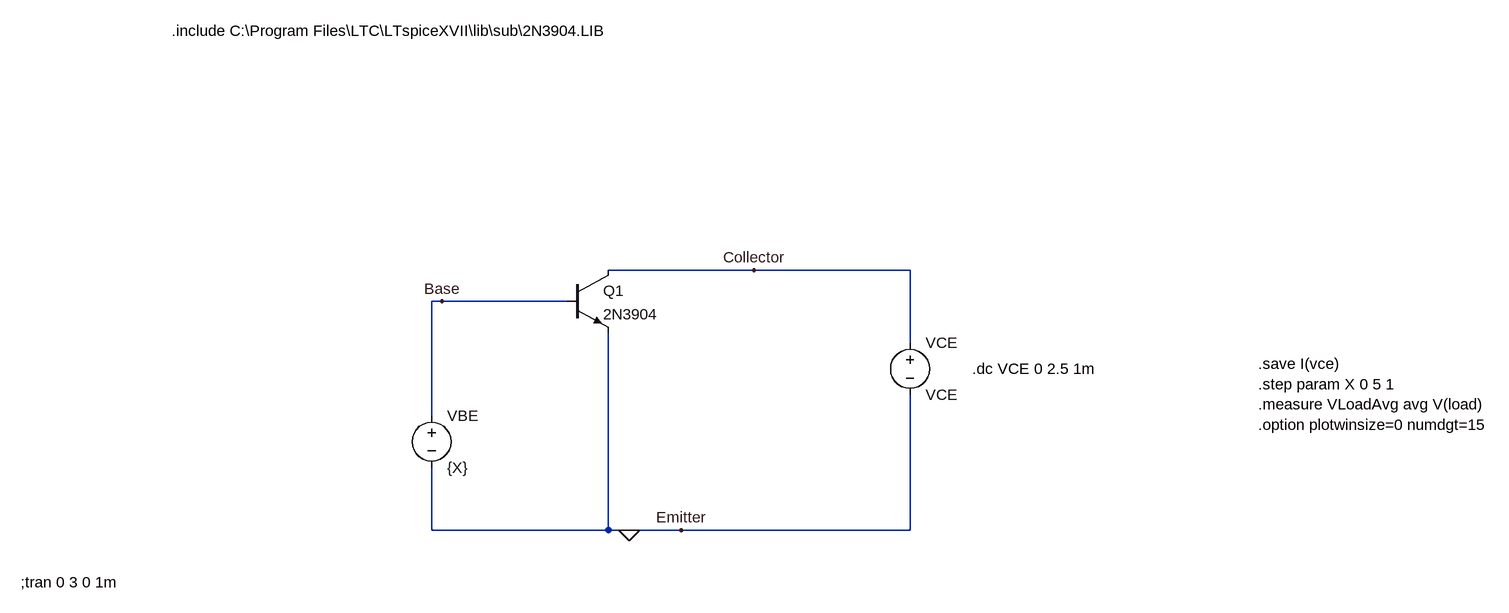
[diagram p0: schematic mp2 task 1B 2N3904 profiling.asc]
mp2 task 1B 2N3904 profiling.asc, the LTspice schematic file:
Version 4
SHEET 1 2560 912
WIRE 1072 400 848 400
WIRE 1312 400 1072 400
WIRE 592 448 576 448
WIRE 784 448 592 448
WIRE 1312 512 1312 400
WIRE 576 624 576 448
WIRE 576 800 576 704
WIRE 848 800 848 496
WIRE 848 800 576 800
WIRE 880 800 848 800
WIRE 960 800 880 800
WIRE 1312 800 1312 592
WIRE 1312 800 960 800
FLAG 880 800 0
FLAG 592 448 Base
FLAG 1072 400 Collector
FLAG 960 800 Emitter
SYMBOL voltage 576 608 R0
WINDOW 123 0 0 Left 0
WINDOW 39 0 0 Left 0
SYMATTR InstName VBE
SYMATTR Value {X}
SYMBOL voltage 1312 496 R0
WINDOW 123 0 0 Left 0
WINDOW 39 0 0 Left 0
SYMATTR InstName VCE
SYMATTR Value VCE
SYMBOL npn 784 400 R0
SYMATTR InstName Q1
SYMATTR Value 2N3904
TEXT -56 880 Left 2 !;tran 0 3 0 1m
TEXT 176 32 Left 2 !.include C:\\Program Files\\LTC\\LTspiceXVII\\lib\\sub\\2N3904.LIB
TEXT 1408 552 Left 2 !.dc VCE 0 2.5 1m
TEXT 1848 544 Left 2 !.save I(vce)\n.step param X 0 5 1\n.measure VLoadAvg avg V(load)\n.option plotwinsize=0 numdgt=15

The netlist it stands for:
* mp2 task 1B 2N3904 profiling.asc
VBE Base 0 {X}
VCE Collector 0 VCE
Q1 Collector Base 0 0 2N3904
.model NPN NPN
.model PNP PNP
.lib standard.bjt
;tran 0 3 0 1m
.include C:\Program Files\LTC\LTspiceXVII\lib\sub\2N3904.LIB
.dc VCE 0 2.5 1m
.save I(vce)
.step param X 0 5 1
.measure VLoadAvg avg V(load)
.option plotwinsize=0 numdgt=15
.backanno
.end